# EAGLE design ble112_breakout_board_v21 (EAGLE 7.7.0)
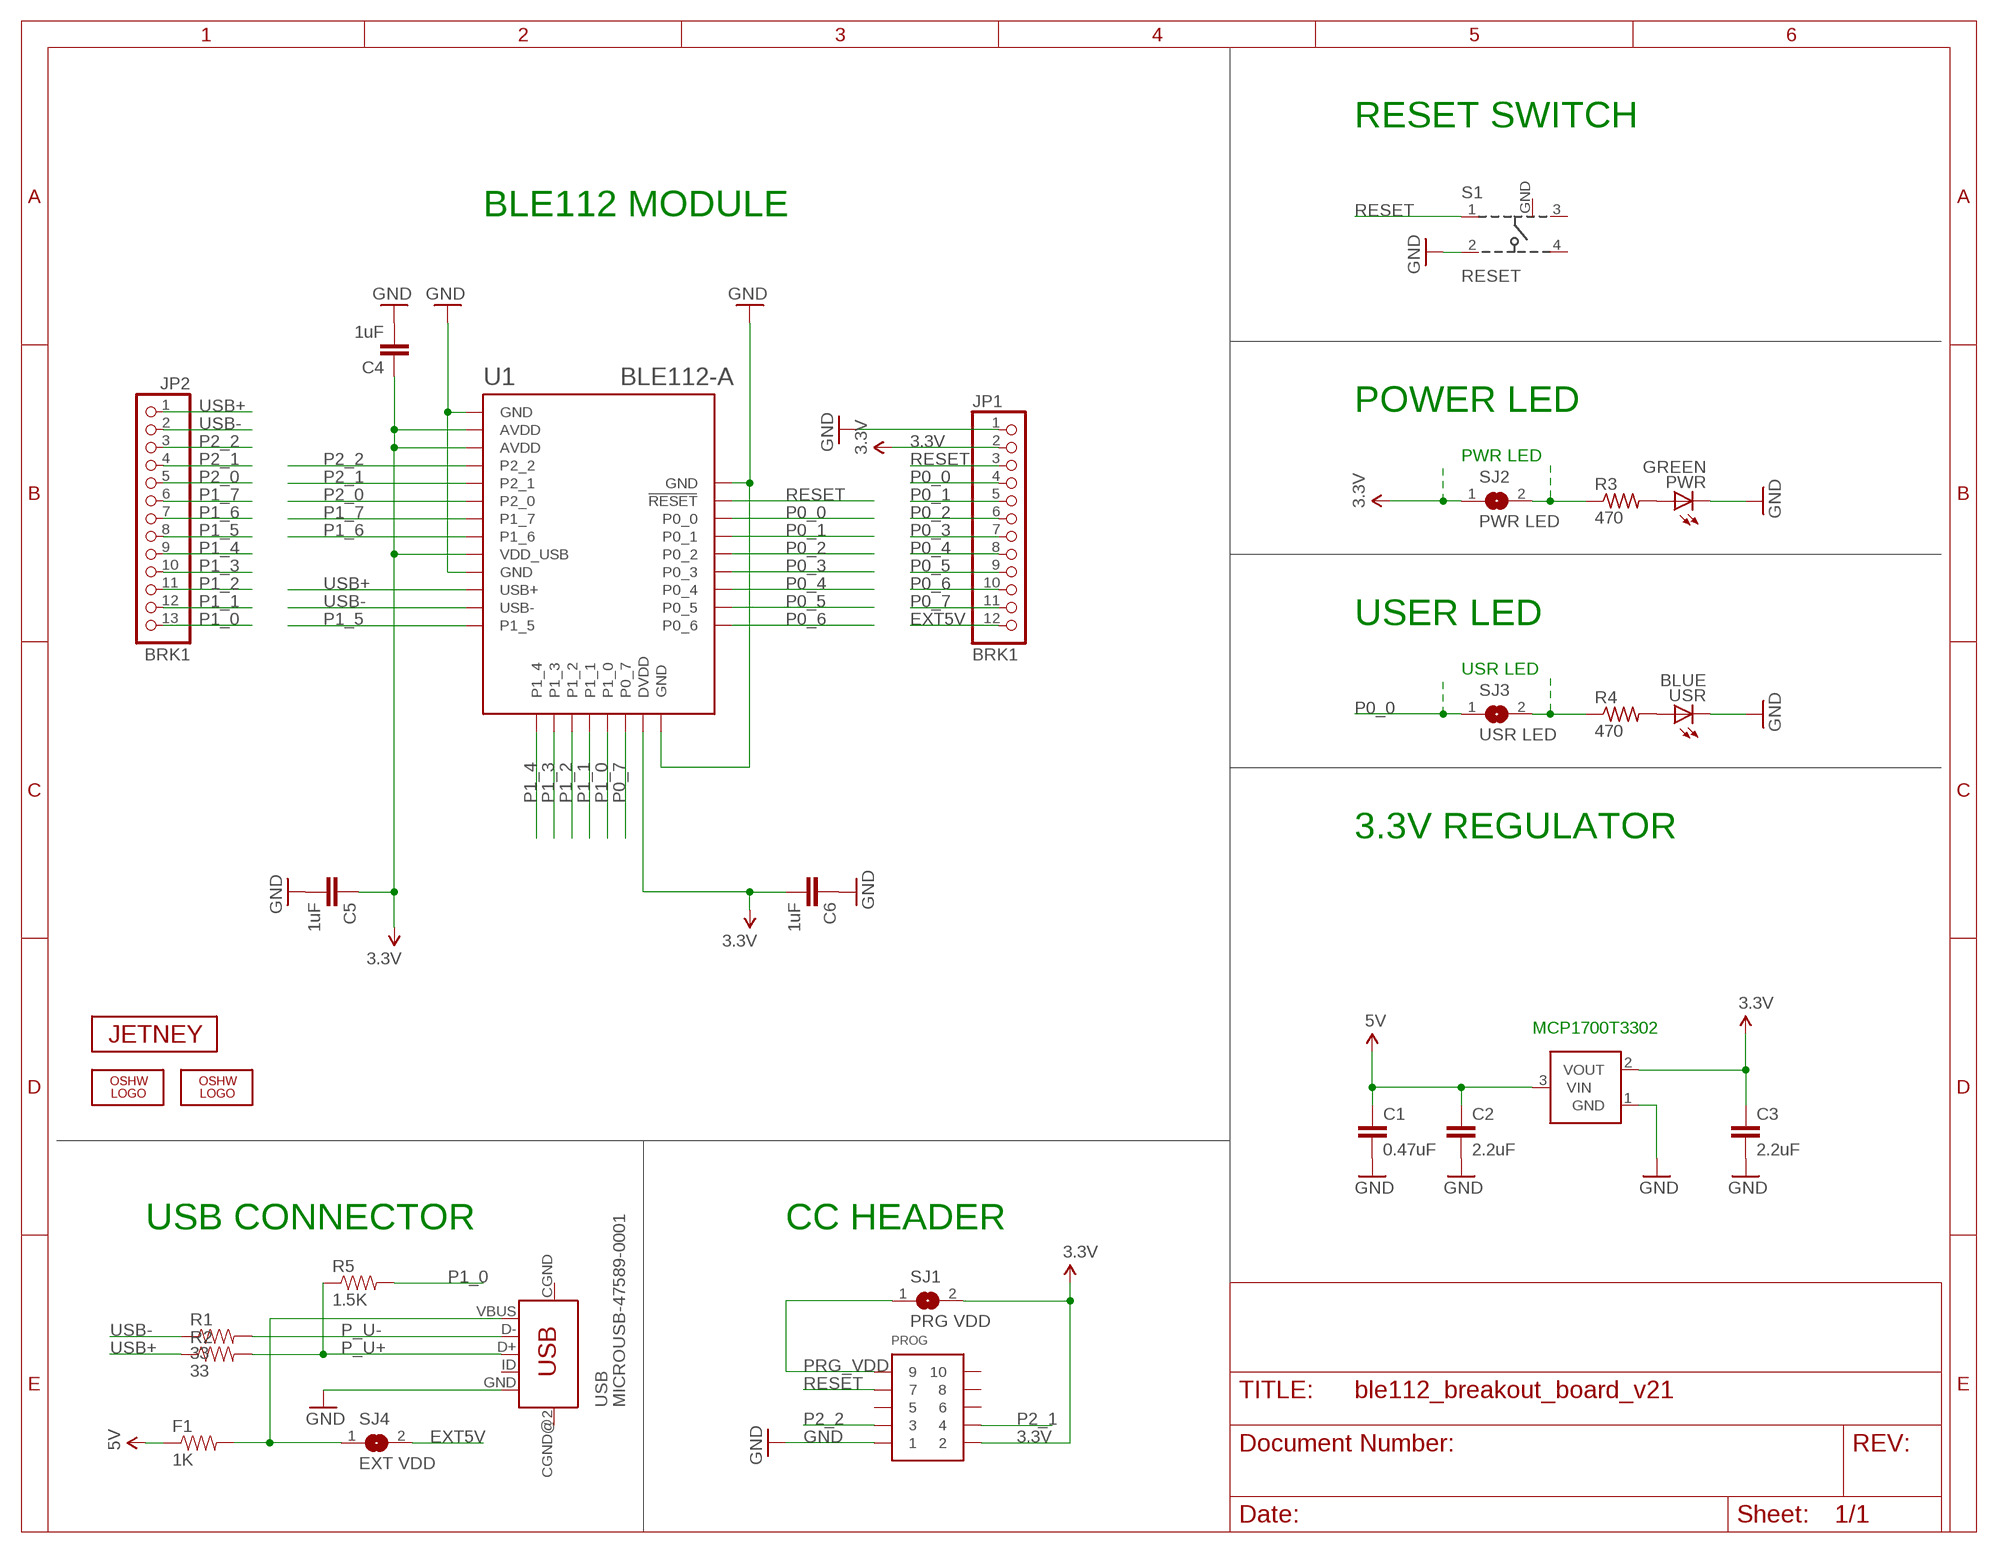
[diagram p0: schematic, sheet 1]

## Parts
C1  0.47uF  CAP0603-CAP  [0603-CAP]
C2  2.2uF  CAP0603-CAP  [0603-CAP]
C3  2.2uF  CAP0603-CAP  [0603-CAP]
C4  1uF  CAP0603-CAP  [0603-CAP]
C5  1uF  CAP0603-CAP  [0603-CAP]
C6  1uF  CAP0603-CAP  [0603-CAP]
F1  1K  RESISTOR0805-RES  [0805]
JP1  BRK1  PINHD-1X12  [1X12]
JP2  BRK1  PINHD-1X13  [1X13]
LOGO1  OSHW_LOGO_FILLX0100-NT  [OSHW_FILLX100_NOTEXT]
LOGO2  OSHW_LOGO_FILLX0100-NT  [OSHW_FILLX100_NOTEXT]
PROG  CONN_5-2-FTSH-V  [FTSH-105-DV]
PWR  GREEN  LEDCHIPLED_0805  [CHIPLED_0805]
R1  33  RESISTOR0603-RES  [0603-RES]
R2  33  RESISTOR0603-RES  [0603-RES]
R3  470  R-US_R0603  [R0603]
R4  470  R-US_R0603  [R0603]
R5  1.5K  RESISTOR0603-RES  [0603-RES]
S1  RESET  101-IG  [101-IG]
SJ1  PRG VDD  SJ  [SJ]
SJ2  PWR LED  SJ  [SJ]
SJ3  USR LED  SJ  [SJ]
SJ4  EXT VDD  SJ  [SJ]
U1  BLE112-A  BLE112-VISUAL-A  [BLE112-A]
U2  MCP1700  [SOT23-3]
U$3  JETNEY-LOGO-12  [JETNEY-LOGO-12]
USB  MICROUSB-47589-0001  [MICROUSB-47589-0001]
USR  BLUE  LEDCHIPLED_0805  [CHIPLED_0805]

## Nets
3.3V [power]: C3.1 C4.1 C5.1 C6.2 JP1.2 PROG.2 SJ1.2 SJ2.1 U1.AVDD U1.AVDD@2(AVDD) U1.DVDD U1.VDD_USB U2.2(VOUT)
5V [power]: C1.1 C2.1 F1.1 U2.3(VIN)
EXT5V [power]: JP1.12 SJ4.2
GND [power]: C1.2 C2.2 C3.2 C4.2 C5.2 C6.1 JP1.1 PROG.1 PWR.C S1.2 U1.GND U1.GND@2(GND) U1.GND@3(GND) U1.GND@4(GND) U2.1(GND) USB.GND USR.C
N$1: PWR.A R3.2
N$3 [power]: R3.1 SJ2.2
N$4: R4.2 USR.A
N$5: R4.1 SJ3.2
P0_0: JP1.4 SJ3.1 U1.P0_0
P0_1: JP1.5 U1.P0_1
P0_2: JP1.6 U1.P0_2
P0_3: JP1.7 U1.P0_3
P0_4: JP1.8 U1.P0_4
P0_5: JP1.9 U1.P0_5
P0_6: JP1.10 U1.P0_6
P0_7: JP1.11 U1.P0_7
P1_0: JP2.13 R5.2 U1.P1_0
P1_1: JP2.12 U1.P1_1
P1_2: JP2.11 U1.P1_2
P1_3: JP2.10 U1.P1_3
P1_4: JP2.9 U1.P1_4
P1_5: JP2.8 U1.P1_5
P1_6: JP2.7 U1.P1_6
P1_7: JP2.6 U1.P1_7
P2_0: JP2.5 U1.P2_0
P2_1: JP2.4 PROG.4 U1.P2_1
P2_2: JP2.3 PROG.3 U1.P2_2
P_U+: R2.2 R5.1 USB.D+
P_U-: R1.2 USB.D-
PRG_VDD [power]: PROG.9 SJ1.1
RESET: JP1.3 PROG.7 S1.1 U1.RESET
USB+: JP2.1 R2.1 U1.USB+
USB-: JP2.2 R1.1 U1.USB-
VBUS [power]: F1.2 SJ4.1 USB.VBUS
Unconnected: PROG.5 PROG.6 PROG.8 PROG.10 S1.3 S1.4 USB.CGND(MTN2) USB.CGND@2(MTN4) USB.ID

## Notes on the sheet
- RESET SWITCH
- BLE112 MODULE
- POWER LED
- PWR LED
- USER LED
- USR LED
- 3.3V REGULATOR
- MCP1700T3302
- USB CONNECTOR | CC HEADER

## Power pins joined to a net without a drawn wire
GND: S1.GND

## Library data of the parts
C1-C6 = SparkFun:CAP: Capacitor Standard 0603 ceramic capacitor, and 0.1" leaded capacitor.
F1 R1 R2 R5 = SparkFun:RESISTOR: Resistor Basic schematic elements and footprints for 0603, 1206, and PTH resistors.
JP1 = sf-pinhead:PINHD-1X12: PIN HEADER
JP2 = sf-pinhead:PINHD-1X13: PIN HEADER
LOGO1 LOGO2 = oshw-logo:OSHW_LOGO_FILL
PROG = pel_misc:CONN_5-2
PWR USR = led:LED: LED OSRAM: - CHIPLED LG R971, LG N971, LY N971, LG Q971, LY Q971, LO R971, LY R971 LH N974, LH R974 LS Q976, LO Q976, LY Q976 LO Q996 - Hyper CHIPLED LW Q18S LB Q993, LB Q99A, LB R99A - SideLED LS A670, LO A670, LY A670, LG A670, LP A670 LB A673, LV A673, LT A673, LW A673 LH A674 LY A675 LS A676, LA A676, LO A676, LY A676, LW A676 LS A679, LY A679, LG A679 - Hyper Micro SIDELED® LS Y876, LA Y876, LO Y876, LY Y876 LT Y87S - SmartLED LW L88C, LW L88S LB L89C, LB L89S, LG L890 LS L89K, LO L89K, LY L89K LS L896, LA L896, LO L896, LY L896 - TOPLED LS T670, LO T670, LY T670, LG T670, LP T670 LSG T670, LSP T670, LSY T670, LOP T670, LYG T670 LG T671, LOG T671, LSG T671 LB T673, LV T673, LT T673, LW T673 LH T674 LS T676, LA T676, LO T676, LY T676, LB T676, LH T676, LSB T676, LW T676 LB T67C, LV T67C, LT T67C, LS T67K, LO T67K, LY T67K, LW E67C LS E67B, LA E67B, LO E67B, LY E67B, LB E67C, LV E67C, LT E67C LW T67C LS T679, LY T679, LG T679 LS T770, LO T770, LY T770, LG T770, LP T770 LB T773, LV T773, LT T773, LW T773 LH T774 LS E675, LA E675, LY E675, LS T675 LS T776, LA T776, LO T776, LY T776, LB T776 LHGB T686 LT T68C, LB T68C - Hyper Mini TOPLED® LB M676 - Mini TOPLED Santana® LG M470 LS M47K, LO M47K, LY M47K Source: http://www.osram.convergy.de LUXEON: - LUMILED® LXK2-PW12-R00, LXK2-PW12-S00, LXK2-PW14-U00, LXK2-PW14-V00 LXK2-PM12-R00, LXK2-PM12-S00, LXK2-PM14-U00 LXK2-PE12-Q00, LXK2-PE12-R00, LXK2-PE12-S00, LXK2-PE14-T00, LXK2-PE14-U00 LXK2-PB12-K00, LXK2-PB12-L00, LXK2-PB12-M00, LXK2-PB14-N00, LXK2-PB14-P00, LXK2-PB14-Q00 LXK2-PR12-L00, LXK2-PR12-M00, LXK2-PR14-Q00, LXK2-PR14-R00 LXK2-PD12-Q00, LXK2-PD12-R00, LXK2-PD12-S00 LXK2-PH12-R00, LXK2-PH12-S00 LXK2-PL12-P00, LXK2-PL12-Q00, LXK2-PL12-R00 Source: www.luxeon.com KINGBRIGHT: KA-3528ASYC Source: www.kingbright.com
R3 R4 = resistor:R-US_: RESISTOR, American symbol
S1 = sf-keyglove:101-IG
SJ1-SJ4 = jumper:SJ: SMD solder JUMPER
U1 = sf-bluegiga:BLE112-VISUAL: Bluetooth Low Energy single-mode module - Bluetooth 4.0 (CC2540). BLE112-A variant has an on-module ceramic chip antenna, BLE112-E variant has U.Fl connector. BLE112-A variant includes keepout/restrict area. Antenna edge of the module should be flush up against the edge of the PCB. See datasheet for variant layout details. The BLE112 is a Bluetooth Smart module targeted for low-power sensors and accessories. It integrates all features required for a Bluetooth Smart application, including Bluetooth radio, software stack, and GATT-based profiles. The BLE112 Bluetooth Smart module can also host end-user applications, which means no external micro controller is required in size or price constrained devices. Morover, ithas flexible hardware interfaces to connect to different peripherals and sensors and can be powered directly from a standard 3V coin cell battery or a pair of AAA batteries. In the lowest power sleep mode it merely consumes 500 nA and will wake up within a few hundred microseconds. http://www.bluegiga.com/en-US/products/bluetooth-4.0-modules/ble112-bluetooth--smart-module https://github.com/jrowberg/sf-oshw Last updated 2014-01-04 by Jeff Rowberg <jeff@rowberg.net>; ANTENNA: On-module ceramic chip antenna
U2 = nonolith:MCP1700: Voltage regulator
U$3 = sf-keyglove:JETNEY-LOGO
USB = sf-keyglove:MICROUSB-47589-0001

## Net classes
0 default: width 0.152 mm, drill 0.33 mm, clearance 0.152 mm
1 power: width 0.254 mm, drill 0.33 mm, clearance 0.152 mm

## Board
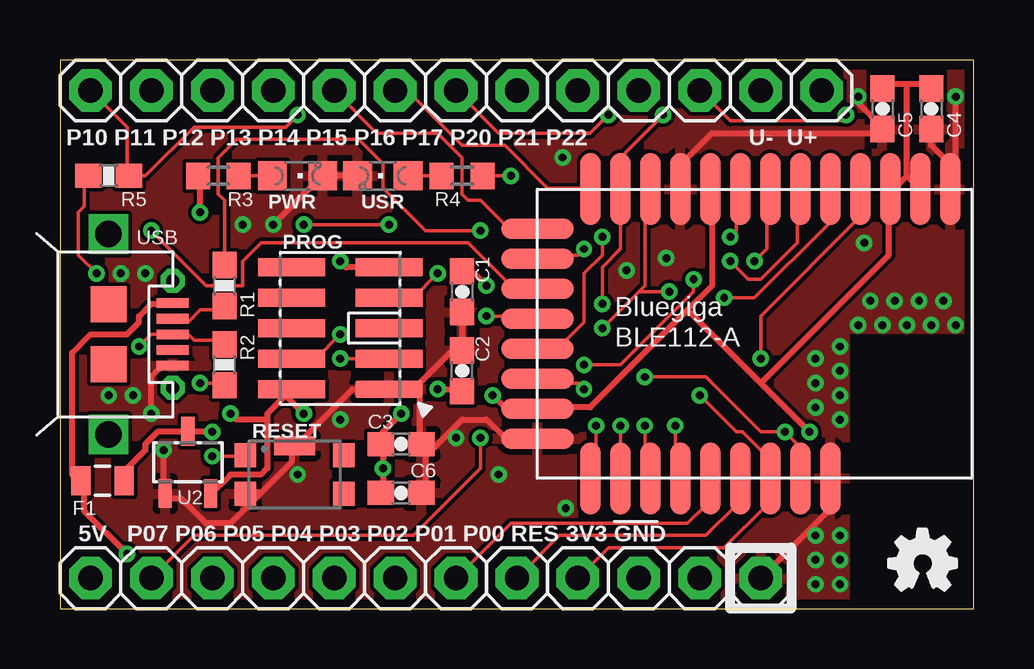
[diagram p1: board, top side]
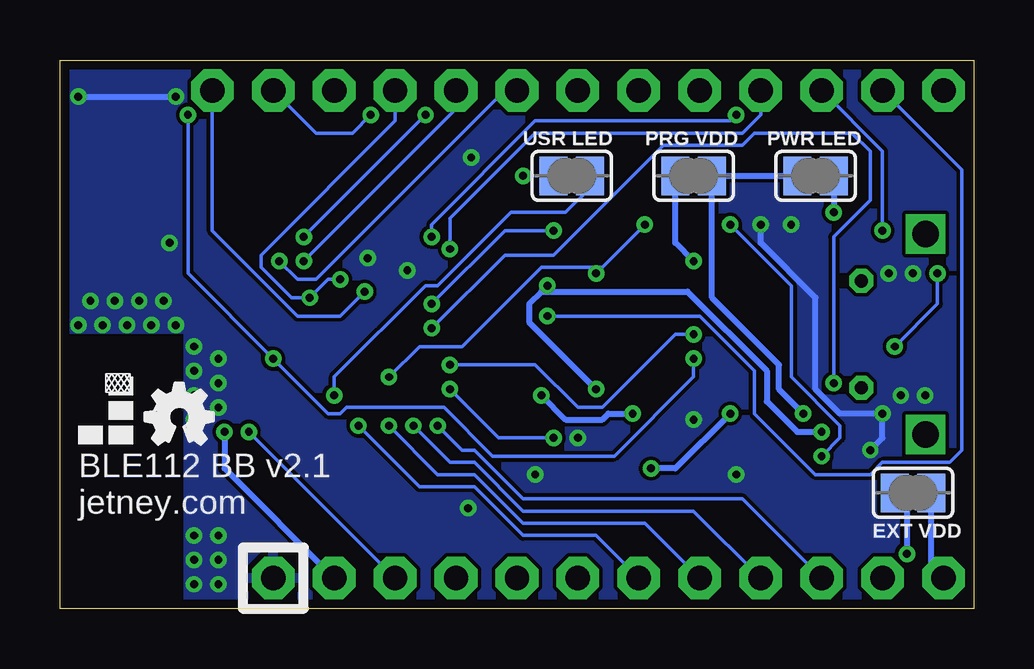
[diagram p2: board, bottom side, seen from below]

Size 38.1 x 22.86 mm. Coordinates in mm from the lower left corner, seen from the top.
Outline: 0,0 38.1,0 38.1,22.86 0,22.86 0,0
Copper layers (1*16): Top 0.0356mm / dielectric 1.5011mm / Bottom 0.0356mm
Design rules "default": minimum track width 6mil, minimum drill 13mil, track to track 6mil, track to pad 6mil, pad to pad 6mil, via to via 6mil, smd to smd 6mil, copper to edge 15mil, drill to drill 6mil, minimum pad ring 7mil, minimum via ring 7mil, stop-mask expansion 4mil, vias tented up to drill 13mil, thermal gap 10mil
vRestrict: area 0.3,19.3 to 32.8,20.1; area 0.5,2.8 to 30.5,3.6

### Footprints (pad centres in the part's own frame; a part is rotated, then mirrored left to right if it is on the bottom)
0603-CAP = smd 1.1 x 1: 1 -0.85,0; 2 0.85,0
0805 = smd 0.8 x 1.2: 1 -0.9,0; 2 0.9,0
1X12 = drill 1.016 pad 1.778 octagon: 1 -13.97,0; 2 -11.43,0; 3 -8.89,0; 4 -6.35,0; 5 -3.81,0; 6 -1.27,0; 7 1.27,0; 8 3.81,0; 9 6.35,0; 10 8.89,0; 11 11.43,0; 12 13.97,0
1X13 = drill 1.016 pad 1.778 octagon: 1 -15.24,0; 2 -12.7,0; 3 -10.16,0; 4 -7.62,0; 5 -5.08,0; 6 -2.54,0; 7 0,0; 8 2.54,0; 9 5.08,0; 10 7.62,0; 11 10.16,0; 12 12.7,0; 13 15.24,0
FTSH-105-DV = smd 0.74 x 2.8: 1 -2.54,-2.03; 2 -2.54,2.03; 3 -1.27,-2.03; 4 -1.27,2.03; 5 0,-2.03; 6 0,2.03; 7 1.27,-2.03; 8 1.27,2.03; 9 2.54,-2.03; 10 2.54,2.03
CHIPLED_0805 = smd 1.2 x 1.2: A 0,-1.05; C 0,1.05
0603-RES = smd 1.1 x 1: 1 -0.85,0; 2 0.85,0
R0603 = smd 1 x 1.1: 1 -0.85,0; 2 0.85,0
101-IG = smd 0.9 x 1: 1 -2.05,0.8; 2 -2.05,-0.8; 3 2.05,0.8; 4 2.05,-0.8 | smd 1.7 x 0.8: GND 0,1.2
SJ = smd 1.168 x 1.6: 1 -0.762,0; 2 0.762,0
BLE112-A = smd 3 x 0.85: AVDD -6.05,6.9; AVDD@2 -6.05,5.65; GND -6.05,8.15; GND@2 -6.05,-3.1; GND@4 6,3.15; P0_0 6,0.65; P0_1 6,-0.6; P0_2 6,-1.85; P0_3 6,-3.1; P0_4 6,-4.35; P0_5 6,-5.6; P0_6 6,-6.85; P1_5 -6.05,-6.85; P1_6 -6.05,-0.6; P1_7 -6.05,0.65; P2_0 -6.05,1.9; P2_1 -6.05,3.15; P2_2 -6.05,4.4; RESET 6,1.9; USB+ -6.05,-4.35; USB- -6.05,-5.6; VDD_USB -6.05,-1.85 | smd 0.85 x 3: DVDD 3.1,-9.05; GND@3 4.35,-9.05; P0_7 1.85,-9.05; P1_0 0.6,-9.05; P1_1 -0.65,-9.05; P1_2 -1.9,-9.05; P1_3 -3.15,-9.05; P1_4 -4.4,-9.05
SOT23-3 = smd 0.55 x 1.2: 1 0.95,1.3; 2 -0.95,1.3; 3 0,-1.3
MICROUSB-47589-0001 = drill 0.55 pad 1 octagon: CGND 0,2.225; CGND@2 0,-2.225 | drill 1.1 pad 1.6 square: CGND@3 -2.675,-4.175; CGND@4 -2.675,4.175 | smd 1.5 x 1.5: CGND@5 -2.675,1.25; CGND@6 -2.675,-1.25 | smd 1.35 x 0.4: D+ 0,0; D- 0,0.65; GND 0,-1.3; ID 0,-0.65; VBUS 0,1.3

### Placement (x,y rotation side)
C1  16.76,13.21 270 top
C2  16.76,9.91 90 top
C3  14.22,6.86 0 top
C4  36.32,20.83 270 top
C5  34.29,20.83 270 top
C6  14.22,4.83 180 top
F1  1.78,5.33 180 top
JP1  15.24,1.27 180 top
JP2  16.51,21.59 180 top
LOGO1  34.54,0.76 0 top
LOGO2  34.54,6.86 0 bottom
PROG  11.68,11.68 90 top
PWR  9.91,18.03 270 top
R1  6.86,13.46 270 top
R2  6.86,10.16 90 top
R3  6.6,18.03 0 top
R4  16.76,18.03 180 top
R5  2.03,18.03 0 top
S1  9.78,5.59 0 top
SJ1  11.68,18.03 0 bottom
SJ2  6.6,18.03 0 bottom
SJ3  16.76,18.03 180 bottom
SJ4  2.54,4.83 0 bottom
U1  28.96,11.43 270 top
U2  5.33,6.1 180 top
U$3  37.34,6.86 0 bottom
USB  4.7,11.43 0 top
USR  13.46,18.03 90 top

### Tracks (layer width: path | path; a pad name or v marks a point on that pad's centre or on a via)
3.3V  (via drill 0.33)
  Top 0.254: 13.46,6.86 v13.46,5.84 13.46,4.83 C6.2 | 8.64,7.87 8.64,8.13 9.4,8.89 | 8.64,7.87 8.64,5.84 8.38,5.59 7.11,5.59 6.35,4.83 U2.2 | 9.4,8.89 PROG.2 9.4,8.89 | 9.4,8.89 v10.16,8.13 | v7.11,8.13 7.37,7.87 8.64,7.87 | 35.31,21.84 36.32,21.84 C4.1 | 35.31,21.84 34.29,21.84 C5.1 | 35.31,18.03 35.31,21.84 | 35.31,18.03 34.8,17.53 U1.AVDD@2 34.54,17.27 34.54,14.73 29.21,9.4 | 35.31,18.03 35.81,17.53 U1.AVDD | 26.16,12.45 27.18,13.46 27.18,17.27 U1.VDD_USB | 26.16,12.45 22.1,8.38 20.07,8.38 U1.DVDD 19.81,8.38 18.54,8.38 v18.03,8.89 | 26.16,12.45 29.21,9.4 | 29.21,9.4 v31.24,7.37 | 13.46,6.86 13.46,7.37 v14.22,8.13 | 13.46,6.86 C3.1
  Bottom 0.254: SJ2.1 SJ1.2 10.92,12.95 8.13,10.16 8.13,9.14 v7.11,8.13 | v13.46,5.84 12.45,5.84 v10.16,8.13 | JP1.2 31.24,5.84 v31.24,7.37 | v14.22,8.13 15.24,8.13 15.49,7.87 17.02,7.87 v18.03,8.89
5V  (via drill 0.33)
  Top 0.254: 5.33,7.37 4.06,7.37 3.56,6.86 3.56,6.6 2.79,5.84 2.79,5.33 F1.1 | v15.75,9.14 16.76,9.14 C2.1 | v17.78,13.46 17.27,13.97 16.76,13.97 C1.1 | v6.35,7.37 5.33,7.37 | 5.33,7.37 U2.3
  Bottom 0.254: v15.75,9.14 18.54,11.94 18.54,12.7 18.03,13.21 | v17.78,13.46 18.03,13.21 | v6.35,7.37 7.37,7.37 8.64,8.64 8.64,9.91 11.94,13.21 18.03,13.21
EXT5V
  Bottom 0.254: SJ4.2 1.78,1.78 JP1.12
GND  (via drill 0.33)
  Top 0.254: 15.24,6.35 15.24,6.86 C3.2 14.99,6.86 14.99,9.4 | 15.24,6.35 15.24,4.83 C6.1 | C1.2 C2.2 16.76,10.67 16.26,10.67 14.99,9.4 | 14.99,9.4 14.73,9.14 PROG.1 | 14.99,9.4 PROG.1 | 19.81,7.11 18.54,7.11 17.78,7.87 16.76,7.87 15.24,6.35 | USR.C PWR.C 10.92,18.03 v8.89,16 | 4.57,4.83 U2.1 | 8.38,4.83 7.87,4.83 S1.2 | 8.38,4.83 9.65,6.1 9.65,6.6 S1.GND 9.91,6.86 12.19,9.14 PROG.1 | 8.38,4.83 7.11,3.56 6.1,3.56 5.08,4.57 4.57,4.57 U2.1 | 25.91,17.53 25.91,18.54 27.18,19.81 34.29,19.81 C5.2 34.29,20.07 33.27,21.08 v33.27,21.34 | C4.2 36.32,19.3 37.08,18.54 37.08,17.53 | 32,5.33 32,4.06 JP1.1 | 37.34,17.53 v37.34,21.34 | v3.81,8.13 3.81,9.65 4.32,10.16 4.57,10.16 USB.GND | v4.32,6.6 4.32,4.83 U2.1
  Bottom 0.254: v37.34,21.34 v33.27,21.34 | v4.32,6.6 3.81,7.11 v3.81,8.13 5.59,8.13 6.6,9.14 6.6,12.95 8.89,15.24 v8.89,16
  other vias: 37.34,11.81 36.32,11.81 35.31,11.81 34.29,11.81 33.27,11.81 32.51,10.92 32.51,9.91 32.51,8.89 32.51,7.87 32.51,3.05 32.51,2.03 32.51,1.02 2.54,13.97 3.56,13.97 2.03,8.89 3.05,8.89 11.68,7.87 18.29,5.59 9.91,5.59 7.62,16 16.51,7.11 33.53,15.24 36.83,12.83 35.81,12.83 34.8,12.83 33.78,12.83 31.5,10.41 31.5,9.4 31.5,8.38 31.5,3.05 31.5,2.03 31.5,1.02 25.27,14.61 23.62,14.1 21.08,4.19 20.95,18.8
  pour Top: 0,22.86 38.1,22.86 38.1,0 0,0
  pour Bottom: 0,22.86 38.1,22.86 38.1,0 0,0
N$1
  Top 0.152: PWR.A R3.2
N$3  (via drill 0.33)
  Top 0.254: v5.84,16.51 SJ2.2 R3.1
  Bottom 0.254: SJ2.2 v5.84,16.51
N$4
  Top 0.152: USR.A R4.2
N$5  (via drill 0.33)
  Top 0.152: v18.8,18.03 R4.1
  Bottom 0.152: SJ3.2 v18.8,18.03
N$6
  Bottom 0.152: 6.1,18.03 7.11,18.03
N$8
  Bottom 0.152: 16.26,18.03 17.27,18.03
N$9
  Bottom 0.152: 11.18,18.03 12.19,18.03
N$10
  Bottom 0.152: 2.03,4.83 3.05,4.83
P0_0  (via drill 0.33)
  Top 0.152: v26.67,8.89 28.19,7.37 28.45,7.37 29.46,6.35 29.46,5.59 U1.P0_0 29.46,5.33 29.46,4.32 27.69,2.54 22.86,2.54 JP1.4
  Bottom 0.152: SJ3.1 16,17.53 17.02,16.51 19.3,16.51 22.35,13.46 22.86,13.46 26.67,9.65 v26.67,8.89
P0_1
  Top 0.152: JP1.5 20.83,3.05 26.92,3.05 28.19,4.32 28.19,5.33 U1.P0_1
P0_2
  Top 0.152: JP1.6 18.8,3.56 26.16,3.56 26.92,4.32 26.92,5.33 U1.P0_2
P0_3  (via drill 0.33)
  Top 0.152: v25.65,7.62 25.65,5.59 U1.P0_3
  Bottom 0.152: v25.65,7.62 23.11,5.08 20.83,5.08 18.8,3.05 15.75,3.05 JP1.7
P0_4  (via drill 0.33)
  Top 0.152: v24.38,7.62 24.38,5.59 U1.P0_4
  Bottom 0.152: v24.38,7.62 22.35,5.59 20.83,5.59 18.8,3.56 13.72,3.56 JP1.8
P0_5  (via drill 0.33)
  Top 0.152: v23.37,7.62 23.37,5.59 U1.P0_5
  Bottom 0.152: v23.37,7.62 21.84,6.1 20.83,6.1 18.8,4.06 11.68,4.06 JP1.9
P0_6  (via drill 0.33)
  Top 0.152: v22.35,7.62 22.35,5.59 U1.P0_6
  Bottom 0.152: v22.35,7.62 21.34,6.6 20.83,6.6 18.8,4.57 9.65,4.57 JP1.10
P0_7  (via drill 0.33)
  Top 0.152: v21.84,9.14 21.59,9.4 20.07,9.4 U1.P0_7 | v17.53,7.11 17.53,5.84 14.73,3.05 5.59,3.05 JP1.11
  Bottom 0.152: v21.84,9.14 19.81,7.11 v17.53,7.11
P1_0  (via drill 0.33)
  Top 0.152: JP2.13 2.79,20.07 2.79,18.03 R5.2 3.56,18.03 5.59,20.07 9.4,20.07 v9.91,20.57 | v22.61,15.49 22.61,14.73 21.84,13.97 21.84,11.94 20.83,10.92 20.07,10.92 U1.P1_0
  Bottom 0.152: v22.61,15.49 22.61,16 18.29,20.32 10.16,20.32 v9.91,20.57
P1_1  (via drill 0.33)
  Top 0.152: v17.78,12.19 19.81,12.19 U1.P1_1
  Bottom 0.152: v17.78,12.19 11.43,12.19 9.14,9.91 9.14,8.13 6.6,5.59 4.32,5.59 3.81,6.1 1.02,6.1 0.51,6.6 0.51,18.29 JP2.12
P1_2  (via drill 0.33)
  Top 0.152: v3.81,15.75 6.1,13.46 7.62,13.46 7.62,14.48 8.38,15.24 17.02,15.24 18.8,13.46 19.81,13.46 U1.P1_2
  Bottom 0.152: v3.81,15.75 3.81,19.05 JP2.11
P1_3  (via drill 0.33)
  Top 0.152: v21.84,14.99 21.59,14.73 20.07,14.73 U1.P1_3
  Bottom 0.152: v21.84,14.99 21.84,16.26 18.29,19.81 9.65,19.81 8.89,20.57 JP2.10
P1_4
  Top 0.152: JP2.9 13.21,19.81 15.75,19.81 16.76,18.8 16.76,17.27 17.02,17.02 17.53,17.02 18.54,16 19.81,16 U1.P1_4
P1_5
  Top 0.152: JP2.8 14.48,21.59 16.76,19.3 18.54,19.3 20.32,17.53 22.1,17.53 U1.P1_5
P1_6  (via drill 0.33)
  Top 0.152: v27.94,15.49 28.19,15.75 28.19,17.27 U1.P1_6 | v22.86,20.57 22.1,19.81 18.29,19.81 JP2.7
  Bottom 0.152: v22.86,20.57 v27.94,15.49
P1_7  (via drill 0.33)
  Top 0.152: v28.96,14.48 29.46,14.99 29.46,17.27 U1.P1_7
  Bottom 0.152: v28.96,14.48 28.19,13.72 27.43,13.72 19.56,21.59 JP2.6
P2_0  (via drill 0.33)
  Top 0.152: v27.94,14.48 28.7,13.72 29.21,13.72 30.73,15.24 30.73,17.27 U1.P2_0
  Bottom 0.152: v27.94,14.48 21.59,20.83 JP2.5
P2_1  (via drill 0.33)
  Top 0.152: PROG.4 10.67,10.41 v11.68,11.43 | v21.84,10.16 23.37,10.16 26.42,13.21 v26.42,13.72 | v27.69,12.95 28.96,12.95 32,16 32,17.27 U1.P2_1
  Bottom 0.152: v11.68,11.43 12.45,11.43 15.49,8.38 16.51,8.38 18.29,10.16 v21.84,10.16 | v26.42,13.72 26.92,13.72 v27.69,12.95 28.45,12.95 29.72,14.22 29.72,14.73 24.13,20.32 JP2.4
P2_2  (via drill 0.33)
  Top 0.152: v11.68,10.41 PROG.3 | v29.21,10.41 29.21,12.19 33.27,16.26 33.27,17.27 U1.P2_2 | JP2.3 27.94,20.32 32.51,20.32 v32.77,20.57
  Bottom 0.152: v11.68,10.41 11.68,9.65 14.99,6.35 20.07,6.35 22.1,8.38 26.16,8.38 26.42,8.13 26.92,8.13 v29.21,10.41 32.77,13.97 v32.77,20.57
P_U+  (via drill 0.33)
  Top 0.152: v1.52,13.97 0.76,14.73 0.76,16.51 1.02,16.76 1.02,18.03 R5.1 | v3.3,10.92 3.81,11.43 USB.D+ 5.33,11.43 5.59,11.18 6.86,11.18 R2.2
  Bottom 0.152: v1.52,13.97 1.52,12.7 v3.3,10.92
P_U-
  Top 0.152: R1.2 6.86,12.45 5.84,12.45 5.33,11.94 4.83,11.94 USB.D-
PRG_VDD  (via drill 0.33)
  Top 0.254: v11.68,14.48 11.94,14.22 PROG.9
  Bottom 0.254: SJ1.1 12.45,15.24 v11.68,14.48
RESET  (via drill 0.33)
  Top 0.152: v6.35,6.35 7.62,6.35 S1.1 | v13.72,16 v10.16,16 | v15.75,13.97 14.73,12.95 PROG.7 | v24.38,9.65 26.92,9.65 29.21,7.37 v30.23,7.37 30.73,6.86 30.73,5.59 U1.RESET
  Bottom 0.152: JP1.3 v30.23,7.37 | v6.35,6.35 5.59,7.11 5.59,7.62 7.62,9.65 7.62,13.46 v10.16,16 | v15.75,13.97 15.49,14.22 | 15.49,14.22 v13.72,16 | v24.38,9.65 23.11,10.92 21.34,10.92 18.03,14.22 15.49,14.22
USB+  (via drill 0.33)
  Top 0.152: v5.84,9.4 6.86,9.4 R2.1 | 24.13,13.21 24.38,13.46 24.38,17.27 U1.USB+ | 24.13,13.21 v22.61,11.68 | 24.13,13.21 v25.4,13.21
  Bottom 0.152: v22.61,11.68 19.56,14.73 17.53,14.73 12.95,19.3 9.65,19.3 9.14,19.81 5.08,19.81 4.32,19.05 4.32,17.02 5.84,15.49 v5.84,9.4 | JP2.1 31.75,15.75 28.19,12.19 26.42,12.19 v25.4,13.21
USB-  (via drill 0.33)
  Top 0.152: R1.1 6.86,17.02 6.6,17.27 6.6,18.8 7.37,19.56 12.45,19.56 13.46,18.54 13.46,17.53 15.24,15.75 v17.53,15.75 | v22.61,12.7 22.61,14.22 23.37,14.99 23.37,17.27 U1.USB- 23.37,17.53 23.37,18.8 v25.15,20.57
  Bottom 0.152: v17.53,15.75 19.56,15.75 v22.61,12.7 | JP2.2 27.43,19.81 25.91,19.81 v25.15,20.57
VBUS  (via drill 0.33)
  Top 0.254: v2.79,2.29 1.02,4.06 1.02,5.33 F1.2 0.76,5.33 0.51,5.59 0.51,10.67 1.27,11.43 2.79,11.43 3.3,11.94 3.3,12.19 3.81,12.7 4.57,12.7 USB.VBUS
  Bottom 0.254: v2.79,2.29 2.79,4.32 SJ4.1

### Text on the board
tPlace: P10 P11 P12 P13 P14 P15 P16 P17 P20 P21 P22 | U- U+ | Bluegiga | BLE112-A | RESET | 5V | P07 P06 P05 P04 P03 P02 P01 P00 RES 3V3 GND
bPlace: PWR LED | PRG VDD | USR LED | BLE112 BB v2.1 | EXT VDD | jetney.com